# Altium schematic sheet Esquematico.SchDoc
size A4; Organization: Altium Limited; Address1: L3, 12a Rodborough Rd; Address2: Frenchs Forest; Address3: NSW; Address4: Australia 2086
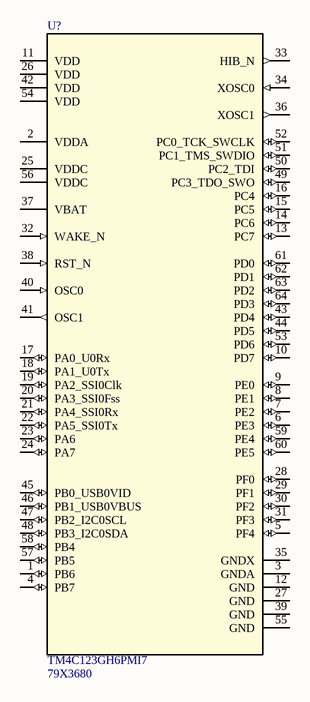
[diagram p0: Esquematico.SchDoc]

## Parts
U?  TM4C123GH6PMI7  Supplier Part Number 1: 79X3680  [PM0064A_N]

## Nets

Not connected (* = marked no-connect by the designer): U? 1(PB6) 2(VDDA) 3(GNDA) 4(PB7) 5(PF4) 6(PE3) 7(PE2) 8(PE1) 9(PE0) 10(PD7) 11(VDD) 12(GND) 13(PC7) 14(PC6) 15(PC5) 16(PC4) 17(PA0_U0Rx) 18(PA1_U0Tx) 19(PA2_SSI0Clk) 20(PA3_SSI0Fss) 21(PA4_SSI0Rx) 22(PA5_SSI0Tx) 23(PA6) 24(PA7) 25(VDDC) 26(VDD) 27(GND) 28(PF0) 29(PF1) 30(PF2) 31(PF3) 32(WAKE_N) 33(HIB_N) 34(XOSC0) 35(GNDX) 36(XOSC1) 37(VBAT) 38(RST_N) 39(GND) 40(OSC0) 41(OSC1) 42(VDD) 43(PD4) 44(PD5) 45(PB0_USB0VID) 46(PB1_USB0VBUS) 47(PB2_I2C0SCL) 48(PB3_I2C0SDA) 49(PC3_TDO_SWO) 50(PC2_TDI) 51(PC1_TMS_SWDIO) 52(PC0_TCK_SWCLK) 53(PD6) 54(VDD) 55(GND) 56(VDDC) 57(PB5) 58(PB4) 59(PE4) 60(PE5) 61(PD0) 62(PD1) 63(PD2) 64(PD3)

## Notes on the sheet
- Title
- Size:
- Date:
- A4
- Number:
- Time:
- Revision:
- Sheet
- of
- File:

## Library data of the parts
U? = TM4C123GH6PMI7: No Description Available; Mfr_Name: Texas Instruments; PartNumber: TM4C123GH6PMTR; Alternate_PartNumber: TM4C123GH6PMT; CompType: IC; Type: DEV; RefDes: RefDes; Copyright: Copyright (C) 2021 Ultra Librarian. All rights reserved.; Manufacturer_Part_Number: TM4C123GH6PMI7; Application_BuildNumber: *; PackageReference: PM0064A; MountType: SMT; RoHS: Y; Manufacturer: Texas Instruments; Supplier 1: Newark